# EAGLE design Tubes (EAGLE 6.3)
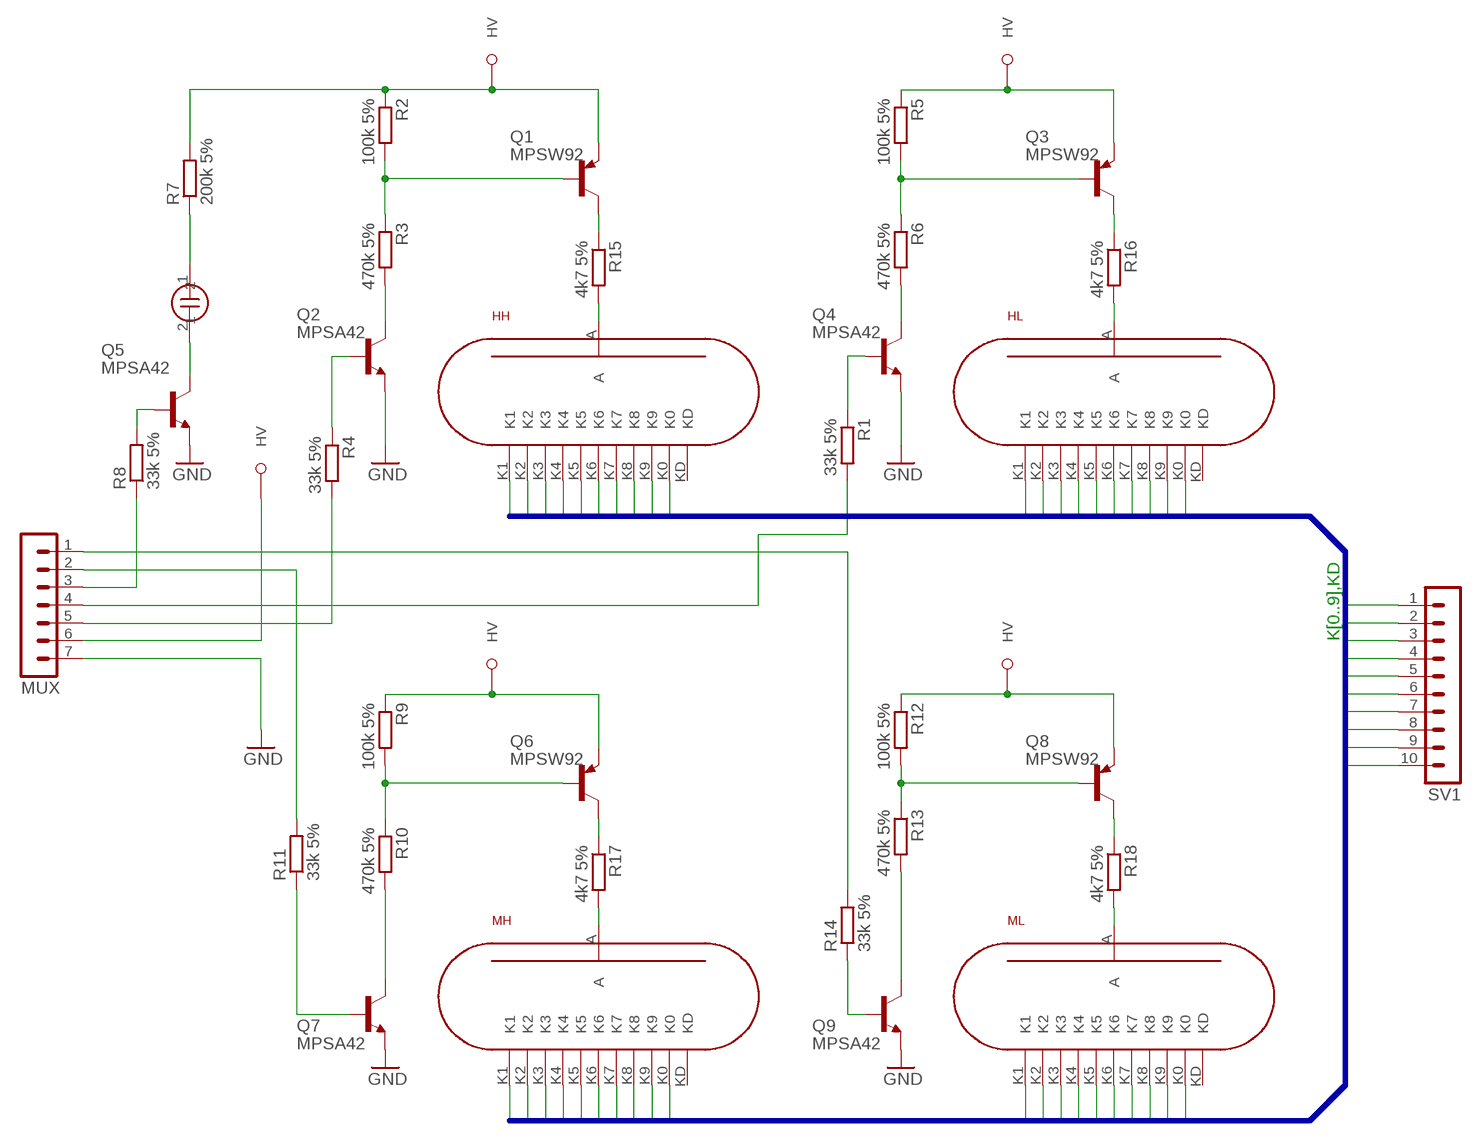
[diagram p0: schematic, sheet 1]

## Parts
HH  LC531  [LC531]
HL  LC531  [LC531]
MH  LC531  [LC531]
ML  LC531  [LC531]
MUX  MA07-1  [MA07-1]
NEON  NEON  [NEON]
Q1  MPSW92  [TO92-CBE]
Q2  MPSA42  MPSA42-NPN-TO92-CBE  [TO92-CBE]
Q3  MPSW92  [TO92-CBE]
Q4  MPSA42  MPSA42-NPN-TO92-CBE  [TO92-CBE]
Q5  MPSA42  MPSA42-NPN-TO92-CBE  [TO92-CBE]
Q6  MPSW92  [TO92-CBE]
Q7  MPSA42  MPSA42-NPN-TO92-CBE  [TO92-CBE]
Q8  MPSW92  [TO92-CBE]
Q9  MPSA42  MPSA42-NPN-TO92-CBE  [TO92-CBE]
R1  33k 5%  R-EU_0204/5  [0204/5]
R2  100k 5%  R-EU_0204/5  [0204/5]
R3  470k 5%  R-EU_0204/5  [0204/5]
R4  33k 5%  R-EU_0204/5  [0204/5]
R5  100k 5%  R-EU_0204/5  [0204/5]
R6  470k 5%  R-EU_0204/5  [0204/5]
R7  200k 5%  R-EU_0204/5  [0204/5]
R8  33k 5%  R-EU_0204/5  [0204/5]
R9  100k 5%  R-EU_0204/5  [0204/5]
R10  470k 5%  R-EU_0204/5  [0204/5]
R11  33k 5%  R-EU_0204/5  [0204/5]
R12  100k 5%  R-EU_0204/5  [0204/5]
R13  470k 5%  R-EU_0204/5  [0204/5]
R14  33k 5%  R-EU_0204/5  [0204/5]
R15  4k7 5%  R-EU_0204/5  [0204/5]
R16  4k7 5%  R-EU_0204/5  [0204/5]
R17  4k7 5%  R-EU_0204/5  [0204/5]
R18  4k7 5%  R-EU_0204/5  [0204/5]
SV1  MA10-1  [MA10-1]

## Nets
DOT: MUX.3 R8.1
GND: MUX.7 Q2.E Q4.E Q5.E Q7.E Q9.E
HH: MUX.5 R4.2
HL: MUX.4 R1.2
HV: MUX.6 Q1.E Q3.E Q6.E Q8.E R2.1 R5.1 R7.2 R9.1 R12.1
K0: HH.K0 HL.K0 MH.K0 ML.K0 SV1.3
K1: HH.K1 HL.K1 MH.K1 ML.K1 SV1.1
K2: HH.K2 HL.K2 MH.K2 ML.K2 SV1.2
K3: HH.K3 HL.K3 MH.K3 ML.K3 SV1.4
K4: HH.K4 HL.K4 MH.K4 ML.K4 SV1.6
K5: HH.K5 HL.K5 MH.K5 ML.K5 SV1.8
K6: HH.K6 HL.K6 MH.K6 ML.K6 SV1.10
K7: HH.K7 HL.K7 MH.K7 ML.K7 SV1.9
K8: HH.K8 HL.K8 MH.K8 ML.K8 SV1.7
K9: HH.K9 HL.K9 MH.K9 ML.K9 SV1.5
MH: MUX.2 R11.2
ML: MUX.1 R14.2
N$1: MH.A R17.2
N$2: ML.A R18.2
N$3: HH.A R15.2
N$4: HL.A R16.2
N$5: Q1.C R15.1
N$6: Q3.C R16.1
N$7: Q6.C R17.1
N$8: Q8.C R18.1
N$9: NEON.1 R7.1
N$10: Q2.B R4.1
N$11: Q4.B R1.1
N$12: Q7.B R11.1
N$13: Q9.B R14.1
N$14: Q2.C R3.2
N$15: Q7.C R10.2
N$16: Q9.C R13.2
N$17: Q4.C R6.2
N$18: NEON.2 Q5.C
N$21: Q1.B R2.2 R3.1
N$22: Q3.B R5.2 R6.1
N$23: Q6.B R9.2 R10.1
N$24: Q8.B R12.2 R13.1
S$1: Q5.B R8.2
Unconnected: HH.KD HL.KD MH.KD ML.KD

## Buses
K[0..9]

## Notes on the sheet
- K[0..9],KD

## Library data of the parts
HH HL MH ML = Various:LC531
MUX = con-lstb:MA07-1: PIN HEADER; OC_FARNELL: unknown; OC_NEWARK: unknown
NEON = Various:NEON
Q1 Q3 Q6 Q8 = transistor-pnp:MPSW92*: PNP Transistror
Q2 Q4 Q5 Q7 Q9 = transistor:*-NPN-: NPN Transistror BF959 corrected 2008.03.06
R1-R18 = rcl:R-EU_: RESISTOR, European symbol
SV1 = con-lstb:MA10-1: PIN HEADER; OC_FARNELL: unknown; OC_NEWARK: unknown

## Board
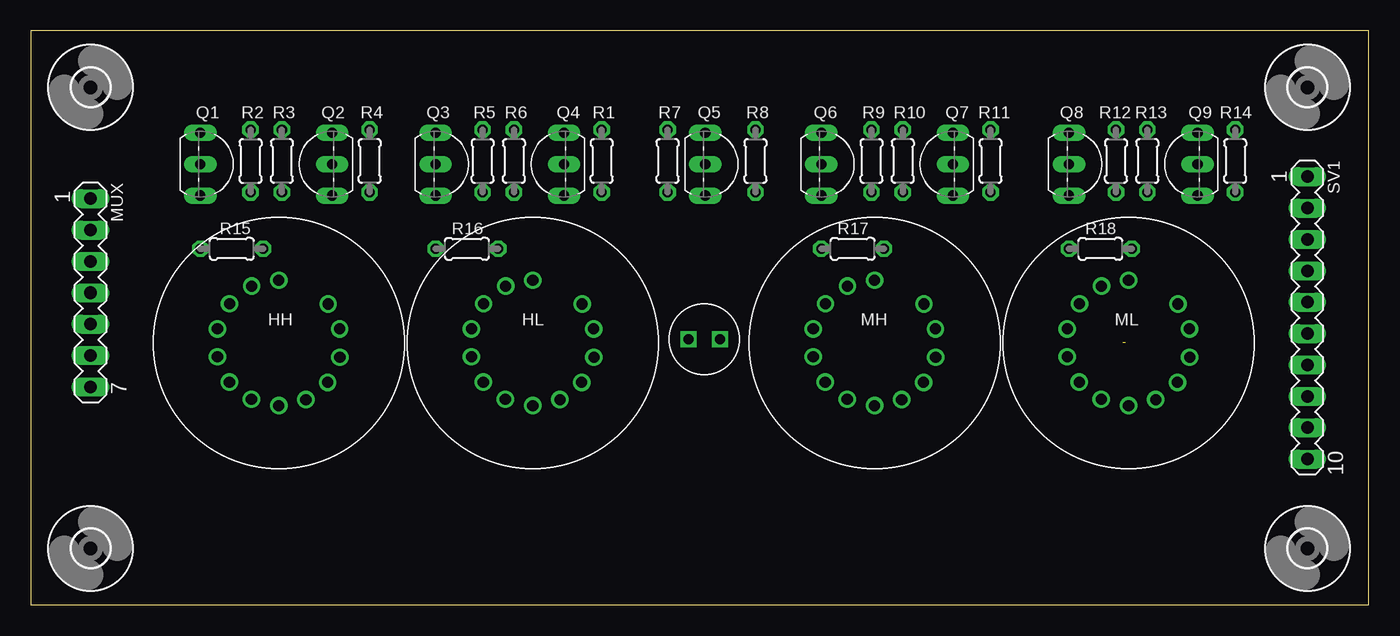
[diagram p1: board, top side]
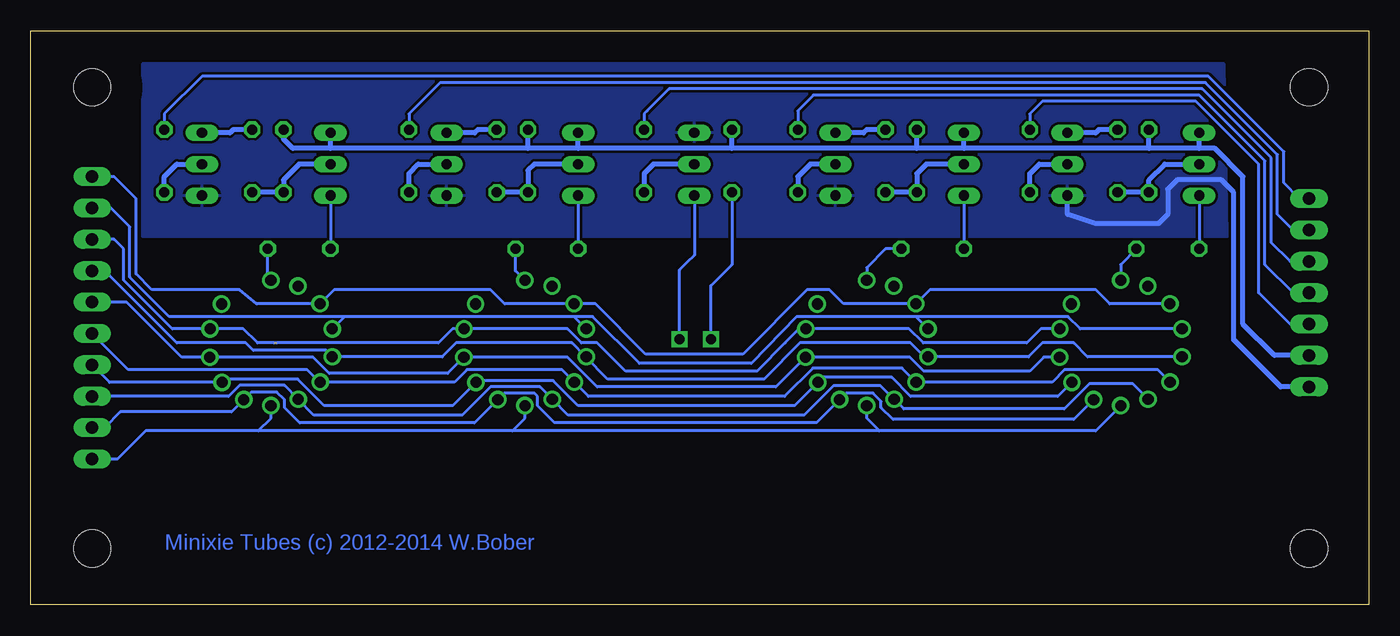
[diagram p2: board, bottom side, seen from below]

Size 108.36 x 46.47 mm. Coordinates in mm from the lower left corner, seen from the top.
Outline: 0,0 108.36,0 108.36,46.47 0,46.47 0,0
Copper layers (1*16): Top 0.035mm / dielectric 1.5mm / Bottom 0.035mm
Design rules "default": minimum track width 10mil, minimum drill 24mil, track to track 8mil, track to pad 8mil, pad to pad 8mil, via to via 8mil, smd to smd 8mil, copper to edge 40mil, drill to drill 8mil, minimum pad ring 10mil, minimum via ring 8mil, stop-mask expansion 4mil, vias tented up to drill 0mil, thermal gap 10mil

### Footprints (pad centres in the part's own frame; a part is rotated, then mirrored left to right if it is on the bottom)
3,0 = hole 3: 0,0
LC531 = drill 0.9 pad 1.4: A 0,5.08; IC -2.196,4.597; K0 4.93,1.139; K1 -3.982,3.169; K2 -4.968,1.139; K3 -4.968,-1.12; K4 -4.001,-3.169; K5 -2.218,-4.555; K6 0,-5.08; K7 2.199,-4.593; K8 3.963,-3.188; K9 4.949,-1.158; KD 4.001,3.15
MA07-1 = drill 1.016 long: 1 -7.62,0; 2 -5.08,0; 3 -2.54,0; 4 0,0; 5 2.54,0; 6 5.08,0; 7 7.62,0
NEON = drill 0.8 square: 1 -1.27,0; 2 1.27,0
TO92-CBE@1 = drill 0.813 long: B 0,0; C 2.54,0; E -2.54,0
0204/5 = drill 0.813 octagon: 1 -2.54,0; 2 2.54,0
MA10-1 = drill 1.016 long: 1 -11.43,0; 2 -8.89,0; 3 -6.35,0; 4 -3.81,0; 5 -1.27,0; 6 1.27,0; 7 3.81,0; 8 6.35,0; 9 8.89,0; 10 11.43,0

### Placement (x,y rotation side)
E$1  [3,0]  4.84,41.9 0 top
E$2  [3,0]  103.39,41.9 0 top
E$3  [3,0]  4.84,4.57 0 top
E$4  [3,0]  103.39,4.57 0 top
HH  20.08,21.2 0 top
HL  40.65,21.2 0 top
MH  68.34,21.2 0 top
ML  88.91,21.2 0 top
MUX  4.84,25.27 270 top
NEON  54.55,21.51 0 top
Q1  MPSW92  [TO92-CBE@1]  13.73,35.68 270 top
Q2  MPSA42  [TO92-CBE@1]  24.4,35.68 90 top
Q3  MPSW92  [TO92-CBE@1]  32.78,35.68 270 top
Q4  MPSA42  [TO92-CBE@1]  43.19,35.68 90 top
Q5  MPSA42  [TO92-CBE@1]  54.62,35.68 270 top
Q6  MPSW92  [TO92-CBE@1]  64.02,35.68 270 top
Q7  MPSA42  [TO92-CBE@1]  74.69,35.68 90 top
Q8  MPSW92  [TO92-CBE@1]  84.09,35.68 270 top
Q9  MPSA42  [TO92-CBE@1]  94.5,35.68 90 top
R1  46.24,35.94 90 top
R2  17.79,35.94 270 top
R3  20.33,35.94 90 top
R4  27.44,35.94 90 top
R5  36.59,35.94 270 top
R6  39.13,35.94 90 top
R7  51.57,35.94 90 top
R8  58.69,35.94 270 top
R9  68.08,35.94 270 top
R10  70.62,35.94 90 top
R11  77.74,35.94 90 top
R12  87.9,35.94 270 top
R13  90.44,35.94 90 top
R14  97.55,35.94 90 top
R15  16.27,28.82 0 top
R16  35.32,28.82 0 top
R17  66.56,28.82 0 top
R18  86.63,28.82 0 top
SV1  103.39,23.24 270 top

### Tracks (layer width: path | path; a pad name or v marks a point on that pad's centre or on a via)
DOT
  Bottom 0.254: R8.1 58.69,39.75 58.43,40 56.65,41.78 13.47,41.78 7.89,36.19 7.89,29.33 6.36,27.81 MUX.3
GND
  Bottom 0.406: MUX.7 7.12,17.65 10.93,21.46 10.93,33.4 11.95,34.41 15.51,34.41 16.27,33.65 16.27,31.62 17.03,30.86 22.11,30.86 24.4,31.62 Q2.E
  pour Bottom: 11.7,43.81 99.33,43.81 99.33,29.84 11.44,29.84
HH
  Bottom 0.254: R4.2 27.44,39.75 26.43,40.76 13.98,40.76 8.9,35.68 8.9,25.27 6.36,22.73 MUX.5
HL
  Bottom 0.254: R1.2 46.24,40 44.97,41.27 13.73,41.27 8.39,35.94 8.39,27.55 6.11,25.27 MUX.4
HV
  Bottom 0.406: 32.78,36.95 Q3.E | 13.73,36.95 17.79,36.95 | 17.79,36.95 32.78,36.95 | 32.78,36.95 36.59,36.95 | 36.59,36.95 51.57,36.95 | 51.57,36.95 64.02,36.95 | 64.02,36.95 68.08,36.95 | 68.08,36.95 84.09,36.95 | 84.09,36.95 Q8.E | 13.73,36.95 Q1.E | 17.79,36.95 R2.1 | 36.59,36.95 R5.1 | 51.57,36.95 R7.2 | 64.02,36.95 Q6.E | 68.08,36.95 R9.1 | R12.1 87.9,37.71 87.13,36.95 84.09,36.95 | 13.73,36.95 12.46,36.95 10.17,34.67 10.17,22.73 7.63,20.19 MUX.6
K0  (1 unrouted)
  Bottom 0.254: 88.43,21.2 90,21.2 91.14,22.34 ML.K0 96.91,22.34 100.85,26.28 100.85,28.82 101.61,29.59 SV1.3 | 88.66,21.2 75.35,21.2 74.21,22.34 MH.K0 64.91,22.34 63.77,21.2 62.5,21.2 60.19,18.92 49.54,18.92 47.26,21.2 46.14,22.34 HL.K0 37.22,22.34 36.08,21.2 27.7,21.2 26.56,22.34 HH.K0
K1
  Bottom 0.254: HL.K1 42.53,24.38 43.68,25.52 45.48,25.52 50.69,20.29 58.56,20.29 62.62,24.37 MH.K1 69.98,24.37 71.13,25.52 83.78,25.52 ML.K1 90.05,24.37 91.45,25.52 98.56,25.52 99.83,26.79 99.83,32.89 101.61,34.67 SV1.1 | HL.K1 36.67,24.42 | HL.K1 35.52,25.52 22.11,25.52 20.96,24.37 HH.K1
K2
  Bottom 0.254: 83.96,22.35 ML.K2 82.95,23.34 | HH.K2 23.35,22.34 24.35,23.34 36.68,23.34 | 36.68,23.34 HL.K2 | 36.68,23.34 46.34,23.34 50,19.55 59.07,19.55 62.85,23.34 64.37,23.34 | 64.37,23.34 MH.K2 | 64.37,23.34 82.95,23.34 | SV1.2 101.87,32.13 100.34,30.6 100.34,26.54 97.14,23.34 82.95,23.34
K3
  Bottom 0.254: HH.K3 22.77,20.08 23.89,21.2 26.43,21.2 27.55,20.08 HL.K3 35.98,20.08 37.1,21.2 46.06,21.2 48.96,18.28 61.63,18.28 63.41,20.08 | 63.41,20.08 MH.K3 | 63.41,20.08 64.53,21.2 73.93,21.2 75.05,20.08 ML.K3 84.45,20.59 90.33,20.59 90.94,21.2 96.53,21.2 102.37,27.05 SV1.4
K4
  Bottom 0.254: HH.K4 17.06,19.02 24.65,19.02 25.64,18.03 HL.K4 37.79,19.17 45.02,19.17 47.31,16.89 63.19,16.89 MH.K4 65.35,19.05 73.04,19.05 74.05,18.03 ML.K4 84.98,18.03 85.99,19.05 100.47,19.05 SV1.6
K5
  Bottom 0.254: HH.K5 19.11,17.9 22.62,17.9 24.65,15.87 37.65,15.87 HL.K5 39.56,17.75 43.34,17.75 45.73,15.36 64.83,15.36 MH.K5 67.12,17.65 71.13,17.65 73.42,15.36 85.44,15.36 ML.K5 87.82,17.77 91.45,17.77 92.34,16.89 SV1.8
K6
  Bottom 0.254: HL.K6 40.65,15.11 39.64,14.09 | 39.64,14.09 22.11,14.09 HH.K6 | 39.64,14.09 69.35,14.09 | MH.K6 68.34,15.11 69.35,14.09 | SV1.10 101.36,11.81 99.07,14.09 89.93,14.09 | 69.35,14.09 89.93,14.09 | ML.K6 88.91,15.11 89.93,14.09
K7
  Bottom 0.254: HH.K7 23.88,15.01 38.52,15.01 39.48,15.97 39.48,16.48 40.14,17.14 42.32,17.14 HL.K7 44.71,14.75 65.95,14.75 67.32,16.12 67.32,16.89 67.58,17.14 70.01,17.14 MH.K7 72.42,14.73 86.58,14.73 87.82,15.97 87.82,16.61 88.43,17.22 90.51,17.22 90.85,16.86 ML.K7 92.11,15.62 101.1,15.62 102.37,14.35 SV1.9
K8
  Bottom 0.254: HH.K8 25.17,16.89 37.1,16.89 38.62,18.41 44.21,18.41 HL.K8 45.48,17.14 46.49,16.12 64.02,16.12 66.05,18.16 72.16,18.16 MH.K8 74.19,16.12 84.59,16.12 86.73,18.28 92.61,18.28 ML.K8 101.98,18.02 SV1.7
K9
  Bottom 0.254: HH.K9 26.32,20.05 27.44,18.92 36.03,18.92 37.16,20.05 HL.K9 45.62,20.05 48.02,17.65 62.5,17.65 64.89,20.05 MH.K9 74.59,18.74 84.19,18.74 85.49,20.05 ML.K9 96.14,20.05 100.6,24.51 SV1.5
MH
  Bottom 0.254: R11.2 77.74,39.75 75.2,42.29 13.22,42.29 7.38,36.44 7.38,31.62 6.11,30.35 MUX.2
ML
  Bottom 0.254: R14.2 97.55,39.75 94.5,42.79 12.97,42.79 6.87,36.7 6.87,34.16 5.6,32.89 MUX.1
N$1
  Bottom 0.254: MH.A 69.1,27.05 R17.2
N$2
  Bottom 0.254: ML.A 89.17,26.54 R18.2
N$3
  Bottom 0.254: R15.2 20.08,27.55 HH.A
N$4
  Bottom 0.254: R16.2 39.13,28.82 40.65,27.3 HL.A
N$5
  Bottom 0.254: Q1.C R15.1
N$6
  Bottom 0.254: Q3.C R16.1
N$7
  Bottom 0.254: Q6.C R17.1
N$8
  Bottom 0.254: Q8.C R18.1
N$9
  Bottom 0.254: R7.1 51.57,27.55 53.28,25.85 NEON.1
N$10
  Bottom 0.406: R4.1 27.44,34.92 26.68,35.68 Q2.B
N$11
  Bottom 0.406: R1.1 46.24,34.67 45.22,35.68 Q4.B
N$12
  Bottom 0.406: R11.1 77.74,34.92 76.97,35.68 Q7.B
N$13
  Bottom 0.406: R14.1 97.55,34.67 96.53,35.68 Q9.B
N$14
  Bottom 0.406: Q2.C 22.11,38.22 21.86,38.48 R3.2
N$15
  Bottom 0.406: Q7.C 72.4,38.22 72.15,38.48 R10.2
N$16
  Bottom 0.406: Q9.C 92.21,38.22 91.96,38.48 R13.2
N$17
  Bottom 0.406: Q4.C 40.91,38.22 40.65,38.48 R6.2
N$18
  Bottom 0.254: Q5.C 54.62,28.32 55.26,27.68 55.64,27.3 55.82,27.12 NEON.2
N$21
  Bottom 0.406: R3.1 R2.2 17.79,34.41 16.52,35.68 Q1.B
N$22
  Bottom 0.406: R6.1 R5.2 36.59,34.92 35.83,35.68 Q3.B
N$23
  Bottom 0.406: R10.1 R9.2 68.08,35.17 67.58,35.68 Q6.B
N$24
  Bottom 0.406: R13.1 R12.2 87.9,34.41 86.63,35.68 Q8.B
S$1
  Bottom 0.406: R8.2 58.69,34.92 57.92,35.68 Q5.B

### Text on the board
Bottom: Minixie Tubes (c) 2012-2014 W.Bober